# EAGLE design MVFDPanel_16S8D (EAGLE 6.2)
Assembly variants: Var1
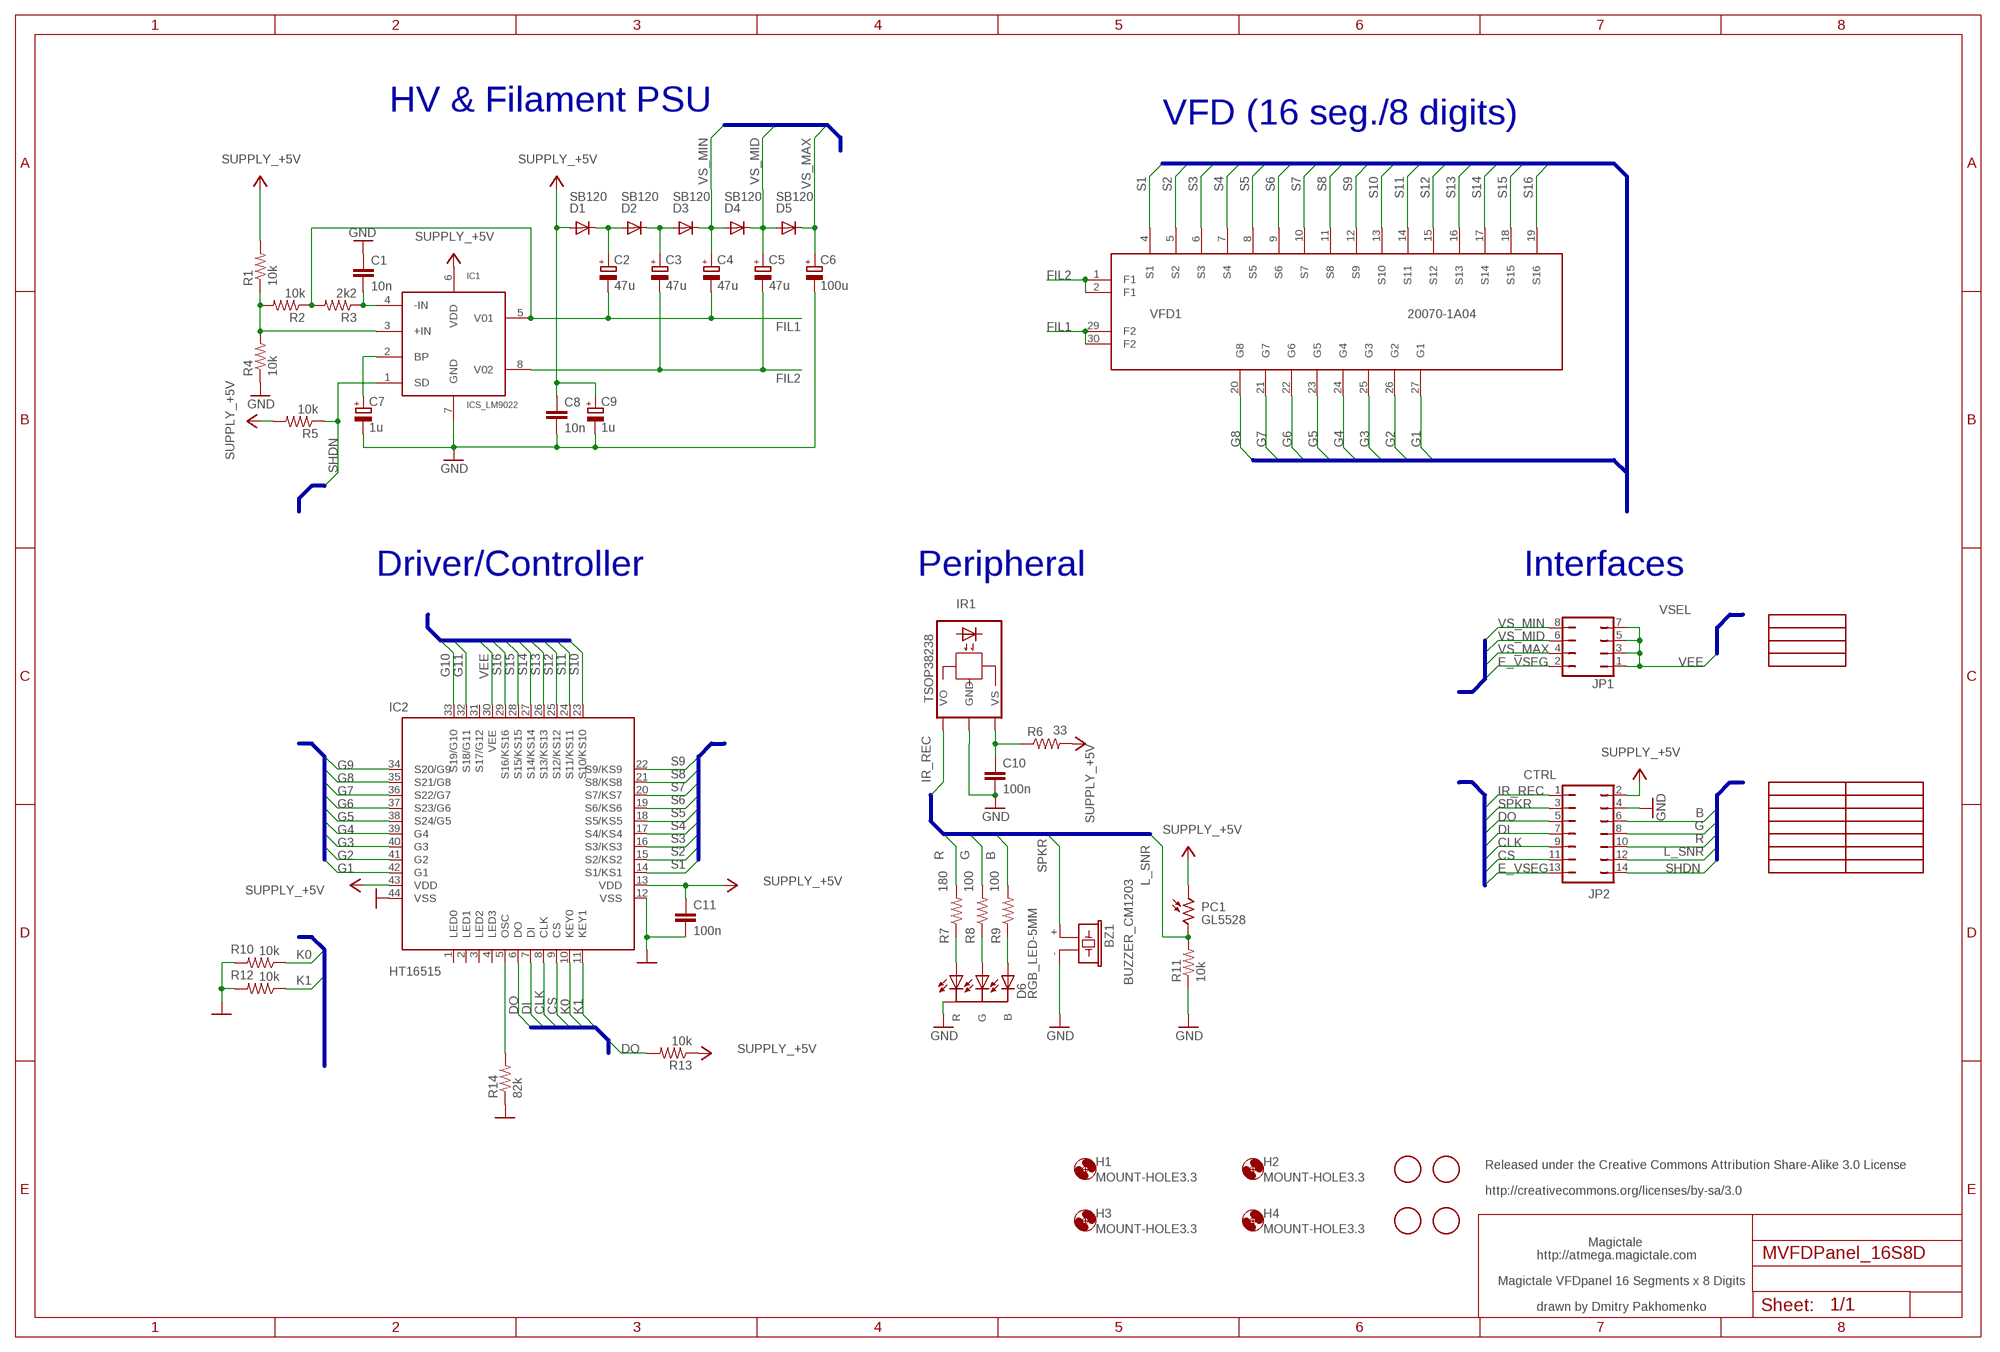
[diagram p0: schematic, sheet 1]

## Parts
BZ1  BUZZER_CM1203  [CEM-1203]
C1  10n  C-EU025-025X050  [C025-025X050]
C2  47u  CPOL-EUE2.5-7  [E2,5-7]
C3  47u  CPOL-EUE2.5-7  [E2,5-7]
C4  47u  CPOL-EUE2.5-7  [E2,5-7]
C5  47u  CPOL-EUE2.5-7  [E2,5-7]
C6  100u  CPOL-EUE3.5-8  [E3,5-8]
C7  1u  CPOL-EUE2-5  [E2-5]
C8  10n  C-EU025-025X050  [C025-025X050]
C9  1u  CPOL-EUE2-5  [E2-5]
C10  100n  C-EU050-025X075  [C050-025X075]
C11  100n  C-EU050-025X075  [C050-025X075]
D1  SB120  [DO41-10]
D2  SB120  [DO41-10]
D3  SB120  [DO41-10]
D4  SB120  [DO41-10]
D5  SB120  [DO41-10]
D6  RGB_LED-5MM  [RGB_LED-5MM]
FIDUTIAL1  FIDUCIAL  [FIDUCIAL_1MM]
FIDUTIAL2  FIDUCIAL  [FIDUCIAL_1MM]
FIDUTIAL3  FIDUCIAL  [FIDUCIAL_1MM]
FIDUTIAL4  FIDUCIAL  [FIDUCIAL_1MM]
H1  MOUNT-HOLE3.3  [3,3]
H2  MOUNT-HOLE3.3  [3,3]
H3  MOUNT-HOLE3.3  [3,3]
H4  MOUNT-HOLE3.3  [3,3]
IC1  ICS_LM9022  [ICS_SOP08]
IC2  HT16515  [LQFP44-10X10]
IR1  TSOP38238  [TSOP38238]
JP1  VSEL  JP4Q  [JP4Q]
JP2  CTRL  JP7Q  [JP7Q]
PC1  GL5528  [GL5528]
R1  10k  R-US_0207/2V  [0207/2V]
R2  10k  R-US_0207/2V  [0207/2V]
R3  2k2  R-US_0207/2V  [0207/2V]
R4  10k  R-US_0207/2V  [0207/2V]
R5  10k  R-US_0207/2V  [0207/2V]
R6  33  R-US_0207/2V  [0207/2V]
R7  180  R-US_0207/2V  [0207/2V]
R8  100  R-US_0207/2V  [0207/2V]
R9  100  R-US_0207/2V  [0207/2V]
R10  10k  R-US_0207/2V  [0207/2V]
R11  10k  R-US_0207/2V  [0207/2V]
R12  10k  R-US_0207/2V  [0207/2V]
R13  10k  R-US_0207/2V  [0207/2V]
R14  82k  R-US_0207/2V  [0207/2V]
U$1  MT_LOGO  [MT_LOGO]
U$2  HDR_7P2R_DESCR  [HDR_7P2R_DESCR]
U$3  JUMP_4X2_DESCR  [JUMP_4X2_DESCR]
VFD1  20070-1A04  [20070-1A04]

## Nets
+5V [power]: C8.1 C9.+ C11.1 D1.A IC1.6(VDD) IC2.13(VDD) IC2.43(VDD) JP2.2 PC1.1 R1.2 R5.2 R6.2 R13.1 ; supply symbol labelled SUPPLY_+5V
B: JP2.6 R9.2
CLK: IC2.8(CLK) JP2.9
CS: IC2.9(CS) JP2.11
DI: IC2.7(DI) JP2.7
DO: IC2.6(DO) JP2.5 R13.2
E_VSEG: JP1.2 JP2.13
FIL1: C2.- C4.- IC1.5(V01) R2.1 R3.2 VFD1.29(F2) VFD1.30(F2)
FIL2: C3.- C5.- IC1.8(V02) VFD1.1(F1) VFD1.2(F1)
G: JP2.8 R8.2
G1: IC2.42(G1) VFD1.27(G1)
G2: IC2.41(G2) VFD1.26(G2)
G3: IC2.40(G3) VFD1.25(G3)
G4: IC2.39(G4) VFD1.24(G4)
G5: IC2.38(S24/G5) VFD1.23(G5)
G6: IC2.37(S23/G6) VFD1.22(G6)
G7: IC2.36(S22/G7) VFD1.21(G7)
G8: IC2.35(S21/G8) VFD1.20(G8)
G9: IC2.34(S20/G9)
G10: IC2.33(S19/G10)
G11: IC2.32(S18/G11)
GND [power]: BZ1.- C1.1 C6.- C7.- C8.2 C9.- C10.2 C11.2 D6.CC IC1.7(GND) IC2.12(VSS) IC2.44(VSS) IR1.GND JP2.4 R4.1 R10.2 R11.1 R12.2 R14.1
IR_REC: IR1.VO JP2.1
K0: IC2.10(KEY0) R10.1
K1: IC2.11(KEY1) R12.1
L_SNR: JP2.12 PC1.2 R11.2
N$2: C10.1 IR1.VS R6.1
N$3: IC2.5(OSC) R14.2
N$6: C7.+ IC1.2(BP)
N$8: D6.R R7.1
N$9: D6.G R8.1
N$10: D6.B R9.1
N$11: IC1.3(+IN) R1.1 R2.2 R4.2
N$30: C2.+ D1.C D2.A
N$31: C3.+ D2.C D3.A
PORTD6: C1.2 IC1.4(-IN) R3.1
R: JP2.10 R7.2
S1: IC2.14(S1/KS1) VFD1.4(S1)
S2: IC2.15(S2/KS2) VFD1.5(S2)
S3: IC2.16(S3/KS3) VFD1.6(S3)
S4: IC2.17(S4/KS4) VFD1.7(S4)
S5: IC2.18(S5/KS5) VFD1.8(S5)
S6: IC2.19(S6/KS6) VFD1.9(S6)
S7: IC2.20(S7/KS7) VFD1.10(S7)
S8: IC2.21(S8/KS8) VFD1.11(S8)
S9: IC2.22(S9/KS9) VFD1.12(S9)
S10: IC2.23(S10/KS10) VFD1.13(S10)
S11: IC2.24(S11/KS11) VFD1.14(S11)
S12: IC2.25(S12/KS12) VFD1.15(S12)
S13: IC2.26(S13/KS13) VFD1.16(S13)
S14: IC2.27(S14/KS14) VFD1.17(S14)
S15: IC2.28(S15/KS15) VFD1.18(S15)
S16: IC2.29(S16/KS16) VFD1.19(S16)
SHDN: IC1.1(SD) JP2.14 R5.1
SPKR: BZ1.+ JP2.3
VEE: IC2.30(VEE) JP1.1 JP1.3 JP1.5 JP1.7
VS_MAX: C6.+ D5.C JP1.4
VS_MID: C5.+ D4.C D5.A JP1.6
VS_MIN: C4.+ D3.C D4.A JP1.8
Unconnected: IC2.1(LED0) IC2.2(LED1) IC2.3(LED2) IC2.4(LED3) IC2.31(S17/G12)

## Buses
CTRLBUS:R,G,B,SPKR,L_SNR,IR_REC,SPKR,DO,DI,CLK,CS,E_VSEG,SHDN,VS_MIN,VS_MID,VS_MAX,E_VSEG,VEE,G[1..12],S[1..16],K0,K1
CTRLBUS:R,G,B,SPKR,L_SNR,IR_REC,SPKR,DO,DI,CLK,CS,E_VSEG,SHDN,VS_MIN,VS_MID,VS_MAX,E_VSEG,VEE,G[1..9],S[1..9],K0,K1

## Notes on the sheet
- HV & Filament PSU
- VFD (16 seg./8 digits)
- Driver/Controller | Peripheral | Interfaces
- Released under the Creative Commons Attribution Share-Alike 3.0 License
- http://creativecommons.org/licenses/by-sa/3.0
- Magictale
- http://atmega.magictale.com
- Magictale VFDpanel 16 Segments x 8 Digits
- drawn by Dmitry Pakhomenko

## Library data of the parts
BZ1 = magictale:BUZZER_CM1203: BUZZER CEM1203, PC Mount 12mm 2.048kHz This is a small 12mm round buzzer that operates around the audible 2kHz range. We drove it directly from a 5V PIC to generate the tones for our Simon demonstration game. Use buzzers to create simple music or user interfaces. Source: http://www.sparkfun.com/datasheets/Components/CEM-1203.pdf; OC_FARNELL: unknown; OC_NEWARK: unknown; SPARKFUN: COM-07950
C1 C8 = rcl:C-EU: CAPACITOR, European symbol; DIGIKEY: 399-4150-ND
C2-C5 = rcl:CPOL-EU: POLARIZED CAPACITOR, European symbol; DIGIKEY: P11232-ND
C6 = rcl:CPOL-EU: POLARIZED CAPACITOR, European symbol; DIGIKEY: P10294-ND
C7 C9 = rcl:CPOL-EU: POLARIZED CAPACITOR, European symbol; DIGIKEY: P13468-ND
C10 C11 = rcl:C-EU: CAPACITOR, European symbol; DIGIKEY: 490-3859-ND
D1-D5 = diode:SB120: DIODE barrier rectifier, 1 A (Fairchild); DIGIKEY: MBR160-ND
D6 = magictale:RGB_LED-5MM; SPARKFUN: COM-09264
FIDUTIAL1-FIDUTIAL4 = adafruit:FIDUCIAL: For use by pick and place machines to calibrate the vision/machine, 1mm By microbuilder.eu
H1-H4 = holes:MOUNT-HOLE: MOUNTING HOLE with drill center marker
IC1 = magictale:ICS_LM9022: LM9022 VFD filament driver The LM9022 is a bridged power amplifier capable of delivering typically 2W of continuous average power into a 10Ω filament load when powered by a 5V power supply.; DIGIKEY: LM9022M-ND; RS-ONLINE: 651-2515
IC2 = magictale:HT16515: HT16515 VFD controller HT16515is a VFD (Vacuum Fluorescent Display) controller/driver that is driven on a 1/4 to 1/12 duty factor. It consists of 16 segment output lines, 4 grid output lines, 8 segment/grid output drive lines, 4 LED output ports, a control circuit, a display memory, and a key scan circuit. Serial data inputs to the HT16515 through a three-line serial interface. This VFD controller/driver is an ideal MCU peripheral device. Features Logic voltage: 5V High-voltage output: VDD-35V max. Multiple display (16-segment & 12-digit to 24-segment & 4-digit) 16×2 matrix key scanning 8 steps dimmer circuit 4 LED output ports 4-bit general purpose input port No external resistors necessary for driver output (provides PMOS open-drain and pull-low resistor output) Serial interface with MCU (CLK, CS, DI,DO) 44-pin LQFP package Source: Data sheet <http://www.holtek.com/pdf/consumer/ht16515v190.pdf>
IR1 = magictale:TSOP38238: TSOP382... IR Receiver Modules for Remote Control Systems The TSOP382 is a miniaturized receiver for infrared remote control systems. A PIN diode and a preamplifier are assembled on a lead frame while the epoxy package acts as an IR filter. The demodulated output signal can be directly decoded by a microprocessor. The TSOP382 is compatible with all common IR remote control data formats. Source: http://www.sparkfun.com/datasheets/Sensors/Infrared/tsop382.pdf; DIGIKEY: 751-1227-ND
JP1 = jumper:JP4Q: JUMPER
JP2 = jumper:JP7Q: JUMPER
PC1 = magictale:GL5528: Photoconductive Cell GL5528 A photocell changes (also called a photodetector, photo resistor, CdS or photoconductive cell) resistance depending on the amount of light it is exposed to. These little sensors make great ambient light triggers (when light in the room turns on, do something). Source: http://www.sparkfun.com/datasheets/Sensors/Imaging/SEN-09088-datasheet.pdf; SPARKFUN: SEN-09088
R1 R2 R4 R5 R10-R13 = resistor:R-US_: RESISTOR, American symbol; DIGIKEY: 10KQBK-ND
R3 = resistor:R-US_: RESISTOR, American symbol; DIGIKEY: 2.2KQTR-ND
R6 = resistor:R-US_: RESISTOR, American symbol; DIGIKEY: 33QBK-ND
R7 = resistor:R-US_: RESISTOR, American symbol; DIGIKEY: 180QBK-ND
R8 R9 = resistor:R-US_: RESISTOR, American symbol; DIGIKEY: 100QBK-ND
R14 = resistor:R-US_: RESISTOR, American symbol; DIGIKEY: 82KQBK-ND
U$1 = magictale:MT_LOGO; LICENSE: CC3.0; PCBREV: REV 1.0, 2013.04.06; PROJECT: MVFDpanel16S8D; URL: http://atmega.magictale.com
U$2 = magictale:HDR_7P2R_DESCR; P1: IR_REC; P10: R; P11: CS; P12: L_SNR; P13: VSEG; P14: SHDN; P2: +5V; P3: SPKR; P4: G ND; P5: DO; P6: B; P7: DI; P8: G; P9: CLK
U$3 = magictale:JUMP_4X2_DESCR; OPT1: 15V; OPT2: 20V; OPT3: 25V; OPT4: EXT
VFD1 = magictale:20070-1A04: 16 Segments 8 Digits VFD

## Net classes
0 default: width 0.406 mm, drill 0.508 mm, clearance 0.254 mm
1 power: width 0.508 mm, drill 0.508 mm, clearance 0.254 mm

## Board
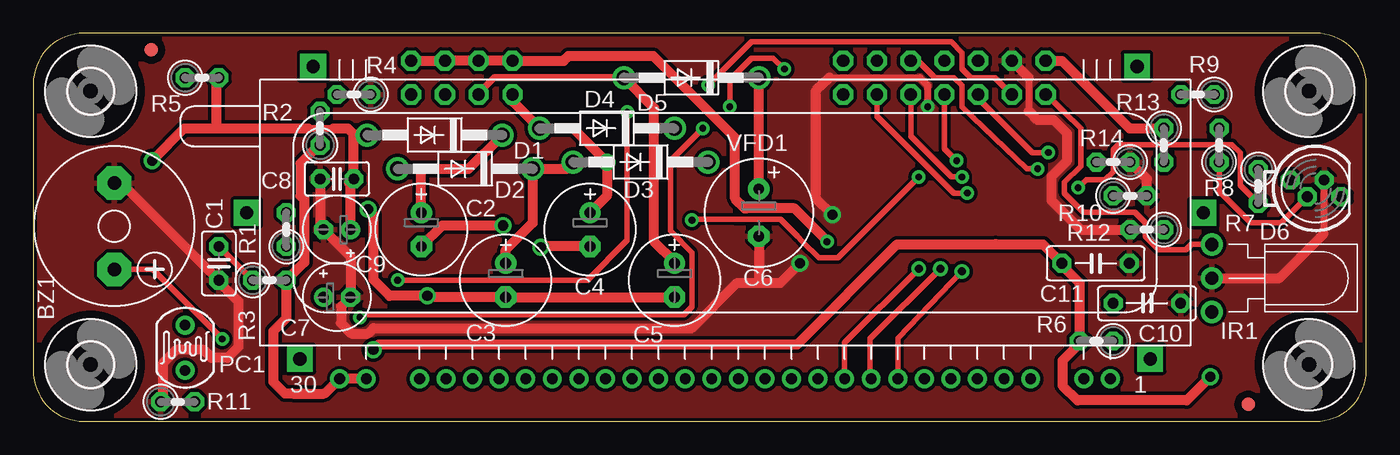
[diagram p1: board, top side]
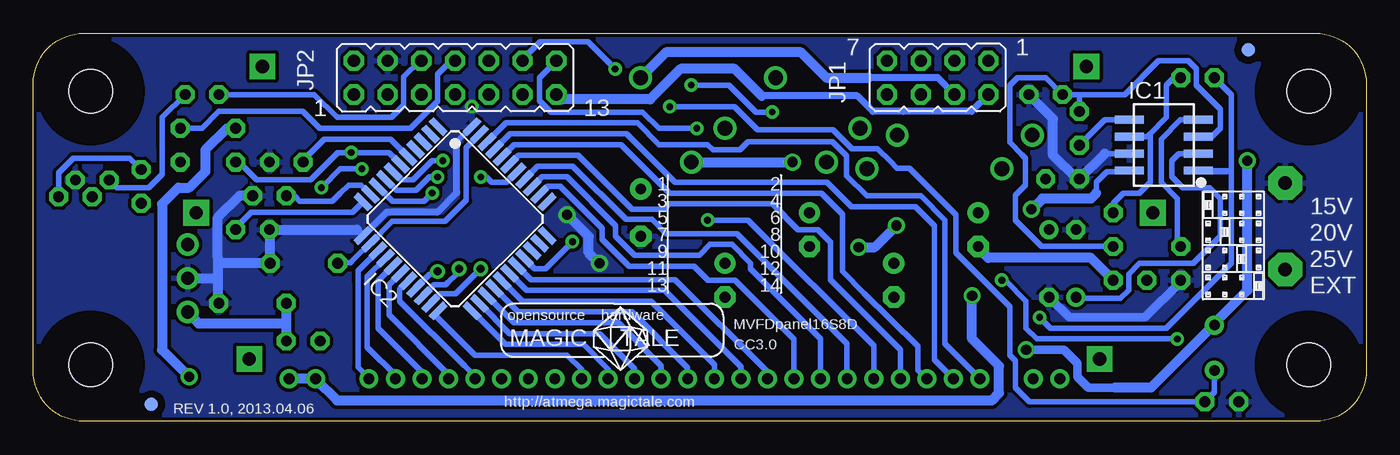
[diagram p2: board, bottom side, seen from below]

Size 100.33 x 29.2 mm. Coordinates in mm from the lower left corner, seen from the top.
Outline: 0,25.39 0,3.81 arc90 3.81,0 96.52,0 arc90 100.33,3.81 100.33,25.39 arc90 96.52,29.2 3.81,29.2 arc90 0,25.39
Copper layers (1*16): Top 0.035mm / dielectric 1.5mm / Bottom 0.035mm
Design rules: minimum track width 8mil, minimum drill 20mil, track to track 8mil, track to pad 8mil, pad to pad 8mil, via to via 8mil, smd to smd 8mil, copper to edge 10mil, drill to drill 8mil, minimum pad ring 12mil, minimum via ring 10mil, stop-mask expansion 4mil, vias tented up to drill 25mil, thermal gap 10mil

### Footprints (pad centres in the part's own frame; a part is rotated, then mirrored left to right if it is on the bottom)
CEM-1203 = drill 1.016 pad 2.54 octagon: + 3.25,0; - -3.25,0
C025-025X050 = drill 0.813 octagon: 1 -1.27,0; 2 1.27,0
E2,5-7 = drill 0.813 pad 1.6: + -1.27,0 | drill 0.813 pad 1.6 octagon: - 1.27,0
E3,5-8 = drill 0.813 pad 1.6: + -1.778,0 | drill 0.813 pad 1.6 octagon: - 1.778,0
E2-5 = drill 0.813 pad 1.27: + -1.016,0 | drill 0.813 pad 1.27 octagon: - 1.016,0
C050-025X075 = drill 0.813 octagon: 1 -2.54,0; 2 2.54,0
DO41-10 = drill 1.118: A 5.08,0; C -5.08,0
RGB_LED-5MM = drill 0.813 octagon: B -1.905,0.635; CC 0.635,0.635; G -0.635,-0.635; R 1.905,-0.635
FIDUCIAL_1MM = smd 1 x 1: 1 0,0
3,3 = hole 3.3: 0,0
ICS_SOP08 = smd 0.6 x 2.2: 1 -1.905,-2.6; 2 -0.635,-2.6; 3 0.635,-2.6; 4 1.905,-2.6; 5 1.905,2.6; 6 0.635,2.6; 7 -0.635,2.6; 8 -1.905,2.6
LQFP44-10X10 = smd 1.5 x 0.5: 1 -5.8,4; 2 -5.8,3.2; 3 -5.8,2.4; 4 -5.8,1.6; 5 -5.8,0.8; 6 -5.8,0; 7 -5.8,-0.8; 8 -5.8,-1.6; 9 -5.8,-2.4; 10 -5.8,-3.2; 11 -5.8,-4; 23 5.8,-4; 24 5.8,-3.2; 25 5.8,-2.4; 26 5.8,-1.6; 27 5.8,-0.8; 28 5.8,0; 29 5.8,0.8; 30 5.8,1.6; 31 5.8,2.4; 32 5.8,3.2; 33 5.8,4 | smd 0.5 x 1.5: 12 -4,-5.8; 13 -3.2,-5.8; 14 -2.4,-5.8; 15 -1.6,-5.8; 16 -0.8,-5.8; 17 0,-5.8; 18 0.8,-5.8; 19 1.6,-5.8; 20 2.4,-5.8; 21 3.2,-5.8; 22 4,-5.8; 34 4,5.8; 35 3.2,5.8; 36 2.4,5.8; 37 1.6,5.8; 38 0.8,5.8; 39 0,5.8; 40 -0.8,5.8; 41 -1.6,5.8; 42 -2.4,5.8; 43 -3.2,5.8; 44 -4,5.8
TSOP38238 = drill 1 pad 1.676: GND 0,-6.54; VO -2.54,-6.54; VS 2.54,-6.54
JP4Q = drill 0.914 octagon: 1 -3.81,-1.27; 2 -3.81,1.27; 3 -1.27,-1.27; 4 -1.27,1.27; 5 1.27,-1.27; 6 1.27,1.27; 7 3.81,-1.27; 8 3.81,1.27
JP7Q = drill 0.914 octagon: 1 -7.62,-1.27; 2 -7.62,1.27; 3 -5.08,-1.27; 4 -5.08,1.27; 5 -2.54,-1.27; 6 -2.54,1.27; 7 0,-1.27; 8 0,1.27; 9 2.54,-1.27; 10 2.54,1.27; 11 5.08,-1.27; 12 5.08,1.27; 13 7.62,-1.27; 14 7.62,1.27
GL5528 = drill 0.8 pad 1.4: 1 -1.7,0; 2 1.7,0
0207/2V = drill 0.813 octagon: 1 -1.27,0; 2 1.27,0
20070-1A04 = drill 0.813: 1 -29,12.5; 2 -27,12.5; 4 -23,12.5; 5 -21,12.5; 6 -19,12.5; 7 -17,12.5; 8 -15,12.5; 9 -13,12.5; 10 -11,12.5; 11 -9,12.5; 12 -7,12.5; 13 -5,12.5; 14 -3,12.5; 15 -1,12.5; 16 1,12.5; 17 3,12.5; 18 5,12.5; 19 7,12.5; 20 9,12.5; 21 11,12.5; 22 13,12.5; 23 15,12.5; 24 17,12.5; 25 19,12.5; 26 21,12.5; 27 23,12.5; 29 27,12.5; 30 29,12.5 | drill 1 pad 1.93 square: P$1 -31,-11; P$2 -36,0; P$3 31,-11; P$4 36,0; P$5 -32,11; P$6 32,11

### Placement (x,y rotation side)
BZ1  6.1,14.68 270 top
C1  13.97,11.89 90 top
C2  29.21,14.43 270 top
C3  35.56,10.62 270 top
C4  41.91,14.43 270 top
C5  48.26,10.62 270 top
C6  54.61,15.7 270 top
C7  22.86,9.35 0 top
C8  22.86,18.24 180 top
C9  22.86,14.43 180 top
C10  83.82,8.89 0 top
C11  79.96,11.89 0 top
D1  30.23,21.54 180 top
D2  32.51,19 180 top
D3  45.72,19.51 180 top
D4  43.18,22.05 180 top
D5  49.53,25.86 180 top
D6  96.52,17.53 0 top
FIDUTIAL1  8.89,27.94 0 top
FIDUTIAL2  91.44,1.27 0 top
FIDUTIAL3  8.89,27.94 0 bottom
FIDUTIAL4  91.44,1.27 0 bottom
H1  96.01,4.27 0 top
H2  96.01,24.84 0 top
H3  4.32,24.84 0 top
H4  4.32,4.27 0 top
IC1  15.24,20.78 90 bottom
IC2  68.58,15.24 315 bottom
IR1  95.25,10.77 270 top
JP1  32.26,25.86 180 bottom
JP2  68.58,25.86 0 bottom
PC1  11.43,5.54 270 top
R1  19.05,14.43 90 top
R2  21.59,22.05 90 top
R3  17.78,10.62 0 top
R4  24.13,24.59 180 top
R5  12.7,25.86 0 top
R6  80.01,6.05 180 top
R7  92.2,17.68 270 top
R8  89.26,20.78 90 top
R9  87.63,24.59 180 top
R10  82.55,16.97 0 top
R11  10.87,1.47 0 top
R12  83.82,14.43 180 top
R13  85.09,20.78 270 top
R14  81.28,19.51 180 top
U$1  55.88,6.35 0 bottom
U$2  44.96,13.46 0 bottom
U$3  13.82,13.36 180 bottom
VFD1  52.07,15.7 180 top

### Tracks (layer width: path | path; a pad name or v marks a point on that pad's centre or on a via)
+5V  (via drill 0.76)
  Top 0.508: 20.73,22.05 22.61,22.05
  Top 0.762: C9.+ 23.88,17.98 | v8.94,19.61 11.38,22.05 13.82,22.05 | 13.82,22.05 13.82,25.71 R5.2 | v25.6,5.39 26.01,5.79 56.08,5.79 57.51,5.79 65.02,13.31 72.34,13.31 | 13.82,22.05 20.73,22.05 | 22.61,22.05 23.11,22.05 23.67,22.05 24.13,21.59 | JP2.2 77.42,27.13 82.5,22.05 R13.1 | v88.59,3.35 86.82,1.58 78.59,1.58 77.47,2.69 77.47,4.57 77.98,5.08 78.94,6.05 R6.2 78.74,10.41 77.42,11.73 C11.1 76,13.31 72.54,13.31 | 72.34,13.31 72.54,13.31 | 72.54,13.31 72.34,13.31 | 72.34,13.31 72.54,13.31 | 72.54,13.31 72.34,13.31 | 72.34,13.31 72.54,13.31 | C8.1 24.13,21.59 | 24.13,21.59 25.09,21.59 D1.A
  Top 1.016: 23.88,17.98 C8.1
  Bottom 0.406: IC2.43 67.74,20.59 67.74,16.62 69.33,15.04 69.55,15.04 73.28,15.04 73.31,15.04 IC2.13 74.99,13.4 76.2,12.19 76.45,11.94 77.37,11.94 C11.1 | R5.2 14.48,25.86 15.04,25.3 15.04,22.86 16.26,21.64 | IC1.6 16.48,21.41 16.26,21.64 | R1.2 19.05,16.41 18.29,17.17 17.07,17.17 16.26,17.98 16.26,21.64
  Bottom 0.635: 18.9,2.54 20.93,2.54 21.74,3.35 21.74,4.37 22.76,5.39 v25.6,5.39
  Bottom 0.762: v8.94,19.61 8.94,9.86 11.43,7.37 PC1.1 11.51,7.24 16.2,2.54 18.9,2.54 | v88.59,3.35 90.63,5.39 90.63,16.36 89.81,17.17 89.41,17.58 88.59,17.58 87.38,18.8 87.38,19.61 87.38,20.42 85.75,22.05 R13.1
B
  Bottom 0.406: R9.2 79.2,24.59 77.47,22.86 73.36,22.86 72.44,23.77 72.44,23.88 72.44,25.91 71.22,27.13 JP2.6
CLK  (via drill 0.51)
  Top 0.406: JP2.9 66.04,21.44 69.09,18.39 v69.9,18.39
  Bottom 0.406: IC2.8 72.98,17.37 71.53,17.37 70.51,18.39 v69.9,18.39
CS  (via drill 0.51)
  Top 0.406: JP2.11 63.5,22.96 69.29,17.17 v70.31,17.17
  Bottom 0.406: 73.91,17.17 IC2.9 73.3,16.56 70.92,16.56 v70.31,17.17
DI  (via drill 0.51)
  Top 0.406: JP2.7 68.58,20.52 v69.49,19.61
  Bottom 0.406: v69.49,19.61 70.31,19.61 71.73,18.16 72.66,18.16 IC2.7
DO  (via drill 0.51)
  Top 0.406: JP2.5 71.12,24.49 71.12,24.28 75.18,20.22 v76.4,20.22
  Bottom 0.406: IC2.6 73.56,20.22 74.78,20.22 v76.4,20.22 77.42,20.22 78.84,18.8 79.45,18.19 83.52,18.19 84.84,19.51 R13.2
E_VSEG
  Bottom 0.508: 45.52,24.49 38.3,24.49 37.13,23.32 34.85,23.32 29.72,23.32 JP1.2
  Bottom 0.762: JP2.13 60.55,24.23 53.9,24.23 51.61,26.52 47.55,26.52 45.52,24.49
FIL1  (via drill 0.76)
  Top 0.406: R2.1 21.49,20.78
  Top 0.762: 21.49,20.78 20.12,19.41 20.12,16.97 20.4,16.76 20.4,11.96 R3.2 19.05,7.77 18.09,6.81 18.09,5.18 18.09,2.95 18.95,2.08 19.51,2.08 20.32,2.08 21.89,2.08 21.95,2.13 22.01,2.13 VFD1.30 VFD1.29 | C4.- 38.25,13.16 v38.2,13.11 | v35.36,14.73 30.79,14.73 C2.-
  Bottom 0.406: 29.26,13.11 29.16,13.11 C2.- | IC1.5 19.68,22.68 R2.1
  Bottom 0.762: R3.2 20.73,12.29 28.45,12.29 29.26,13.11 | v38.2,13.11 36.98,13.11 v35.36,14.73
FIL2  (via drill 0.76)
  Top 0.762: C5.- C3.- 29.77,9.35 v29.67,9.45 26.82,9.45 25.6,10.67 25.6,15.55 v25.2,15.95
  Bottom 0.406: IC1.8 17.84,18.84 17.88,18.8 19.51,18.8 20.32,17.98 20.32,17.17
  Bottom 0.762: 20.32,17.17 20.73,16.76 24.38,16.76 v25.2,15.95 | v29.67,9.45 29.67,6.2 29.26,5.79 27.64,4.17 27.64,2.13 28.19,1.58 77.47,1.58 79.07,3.18 VFD1.2 VFD1.1
G
  Bottom 0.406: R8.2 87.63,22.05 86.36,23.32 80.06,23.32 78.79,22.05 71.93,22.05 69.9,24.08 69.9,26.11 68.89,27.13 JP2.8
G1
  Bottom 0.406: IC2.42 64.76,22.45 54.86,22.45 53.24,20.83 49.58,20.83 49.17,20.42 47.14,20.42 46.53,21.03 40.18,21.03 39.12,19.96 39.12,18.54 39.12,18.49 37.59,16.97 33.53,16.97 31.7,15.14 31.7,12.29 31.7,5.83 VFD1.27
G2
  Bottom 0.406: IC2.41 64.44,21.64 55.68,21.64 52.02,17.98 44.09,17.98 43.08,17.98 40.59,17.98 38.76,16.15 33.93,16.15 32.51,14.73 32.51,11.89 32.51,4.64 VFD1.26
G3
  Bottom 0.406: IC2.40 64.12,20.83 56.08,20.83 52.43,17.17 43.48,17.17 42.67,17.17 41,17.17 39.42,15.6 39.42,11.28 37.8,9.65 33.73,5.64 33.73,3.86 VFD1.25
G4
  Bottom 0.406: IC2.39 63.8,20.02 59.33,20.02 55.27,15.95 52.83,15.95 52.43,16.36 44.7,16.36 42.77,14.43 42.67,14.43 41.45,14.43 41.25,14.43 40.39,13.56 40.34,13.51 40.34,10.67 35.36,5.69 35.07,5.4 VFD1.24
G5  (via drill 0.51)
  Top 0.406: 55.68,15.19 52.83,15.19 49.63,15.19 v49.58,15.14 | 55.68,15.19 56.24,15.19 | 56.24,15.19 55.68,15.19 | 55.68,15.19 56.24,15.19 | 56.24,15.19 57.51,13.92 57.91,13.51 59.13,12.29 60.55,12.29 61.37,13.11 v66.65,18.39
  Bottom 0.406: VFD1.23 37.07,5.68 46.33,14.94 46.53,15.14 v49.58,15.14 | v66.65,18.39 66.24,18.39 65.84,17.98 64.7,17.98 IC2.38
G6
  Bottom 0.406: VFD1.22 39.07,5.85 47.35,14.12 52.63,14.12 52.7,14.12 53.77,15.19 55.68,15.19 55.73,15.19 59.74,19.2 62.35,19.2 IC2.37
G7
  Bottom 0.406: IC2.36 62.04,18.39 60.15,18.39 56.49,14.73 56.49,13.92 55.07,12.5 50.19,12.5 49.38,13.31 47.75,13.31 46.33,11.89 46.33,11.48 41.07,6.22 VFD1.21
G8
  Bottom 0.406: VFD1.20 43.07,6.19 47.5,10.62 47.55,10.62 49.58,10.62 49.58,10.67 50.6,11.68 55.47,11.68 57.51,13.72 57.51,14.53 60.63,17.65 60.66,17.68 61.59,17.68 61.62,17.68 IC2.35 62.27,17.08
G9
  Bottom 0.406: IC2.34 61.65,16.48
G10
  Bottom 0.406: IC2.33
GND  (via drill 0.51, 0.76)
  Top 0.508: 74.93,25.86 74.93,23.32 | 59.94,25.86 66.75,25.86 67.31,25.3 v67.31,23.67 | 97.13,14.12 97.13,18.14 D6.CC
  Top 0.762: C8.2 21.59,14.68 C9.- 23.88,12.4 C7.- 23.16,8.64 23.16,7.42 23.98,6.6 25.2,6.6 25.6,7.01 49.58,7.01 52.98,10.41 54.86,10.41 | JP2.4 74.93,25.86 | R12.2 78.84,14.43 76.66,16.61 76.66,18.44 77.42,19.2 77.83,19.61 77.83,20.63 77.83,21.64 77.22,22.25 76.81,22.66 75.59,22.66 74.93,23.32 | BZ1.- 6.66,17.93 C1.1 13.97,10.52 15.44,9.04 15.44,5.59 14.63,4.77 13.41,4.77 13.01,5.18 12.8,5.39 10.77,5.39 9.75,4.37 9.75,1.63 R11.1 | 54.86,10.41 56.24,10.41 v57.71,11.89 | C6.- 54.61,10.67 54.86,10.41 | v60.15,15.55 58.93,16.76 58.93,24.89 59.94,25.86 | IR1.GND 93.78,10.77 97.13,14.12 | R10.2 83.82,18.24 R14.1
  Bottom 0.406: IC1.7 19.68,20.14 | v67.31,23.67 | 68.45,20.9 68.45,21.02 IC2.44 | 68.45,17.27 68.45,17.2
  Bottom 0.508: 75.97,14.43 IC2.12 73.73,15.75 73.71,15.75 69.95,15.75 69.9,15.75 68.45,17.2 | 68.45,17.27 68.45,20.9 | 67.26,22.22 IC2.44
  Bottom 0.635: C7.- 22.35,7.82 16.66,7.82 13.97,10.52
  Bottom 0.762: R12.2 75.97,14.43 | R10.2 84.73,16.97 84.81,16.97 86.44,15.34 86.44,12.29 86.44,11.68 | R12.2 82.8,14.43 | 19.68,20.14 C8.2 21.79,18.24 23.57,20.02 23.57,22.76 R4.1 | v57.71,11.89 58.52,12.7 58.52,13.92 v60.15,15.55 | 13.97,10.52 C1.1 | 86.44,11.68 86.44,10.92 | 86.44,10.92 86.44,8.97 C10.2 | IR1.GND 86.59,10.77 86.44,10.92 | 86.44,11.68 86.23,11.89 C11.2 82.5,14.38 R12.2
  pour Top: 100.33,3.81 100.33,25.4 arc90 96.52,29.21 3.81,29.21 arc90 0,25.4 0,3.81 arc90 3.81,0 96.52,0 arc90
  pour Bottom: 100.33,3.81 100.33,25.4 arc90 96.52,29.21 3.81,29.21 arc90 0,25.4 0,3.81 arc90 3.81,0 96.52,0 arc90
IR_REC
  Top 0.406: JP2.1 76.3,24.59 77.62,23.27 78.84,22.05 78.84,19.2 77.62,17.98 77.62,17.17 79.05,15.75 82.91,15.75 83.72,14.94 83.72,13.92 84.73,12.9 86.77,12.9 87.17,13.31 IR1.VO
K0
  Bottom 0.406: R10.1 80.67,16.97 80.26,16.56 77.83,16.56 77.22,17.17 76.61,17.78 75.64,17.78 IC2.10
K1
  Bottom 0.406: R12.1 85.09,14.58 83.92,15.75 79.65,15.75 76.27,15.75 IC2.11
L_SNR  (via drill 0.51)
  Top 0.406: v52.43,23.67 52.43,25.71 54.05,27.33 55.68,27.33 56.49,26.52 v56.54,26.52
  Bottom 0.305: 37.08,20.52 38,20.52
  Bottom 0.406: JP2.12 63.5,27.23 62.18,28.55 58.57,28.55 v56.54,26.52 | v52.43,23.67 47.55,23.67 45.82,21.95 40.13,21.95 38.71,20.52 38,20.52 37.08,20.52 36.78,20.52 35.81,19.56 35.31,19.05 34.39,19.05 34.34,19 30.89,15.55 30.89,12.7 26.82,8.64 26.82,4.98 26.42,4.57 26.42,2.54 25.6,1.73 25.35,1.47 R11.2 11.43,2.18 PC1.2
N$2
  Bottom 0.762: IR1.VS 88.71,8.19 87.88,7.37 81.53,7.37 81.28,7.62 | C10.1 81.28,7.62 | 81.28,7.62 R6.1
N$3
  Bottom 0.406: IC2.5 73.44,21.23 77.62,21.23 78.44,21.23 80.01,19.66 R14.2
N$6
  Bottom 0.406: IC1.2 14.1,20.14 14.63,19.61 14.63,18.39 13.82,17.58 11.79,17.58 10.97,16.76 10.97,13.92 13.01,11.89 17.07,11.89 17.88,11.07 17.88,9.86 18.49,9.25 21.74,9.25 C7.+
N$8
  Bottom 0.406: R7.1 93.07,19.81 97.33,19.81 98.35,18.8 98.42,18.72 D6.R
N$9
  Top 0.406: R8.1 89.26,17.32 89.41,17.17 89.81,16.76 90.63,15.95 91.64,14.94 93.93,14.94 D6.G
N$10
  Bottom 0.406: 89,24.49 R9.1 90.63,22.86 90.63,20.83 90.63,20.63 90.63,18.59 91.64,17.58 94.03,17.58 D6.B
N$11
  Bottom 0.406: IC1.3 11.61,21.41 10.97,22.05 10.97,23.47 12.8,25.3 12.8,26.52 13.41,27.13 15.65,27.13 18.19,24.59 21.59,24.59 | R1.1 24.43,13.16 26.42,15.14 26.42,17.02 25.65,17.78 25.65,18.8 25.65,19.05 25.65,19.81 25.91,20.07 26.82,20.98 26.82,25.3 26.26,25.86 24.13,25.86 R4.2 21.59,24.59 | R2.2 21.59,24.59
N$30
  Top 0.762: D2.A 29.21,19 | 29.21,19 31.5,19 32.77,19 D1.C | C2.+ 29.21,19
N$31
  Top 0.762: C3.+ 35.56,12.9 37.59,14.94 D2.C 40.13,19 D3.A
PORTD6
  Top 0.406: R3.1 C1.2
  Bottom 0.406: IC1.4 13.99,22.68 15.44,21.23 15.44,17.98 14.22,16.76 14.22,13.41 C1.2
R  (via drill 0.51)
  Top 0.406: v75.59,19 74.78,19 69.9,23.67 69.9,25.3 69.29,25.86 67.87,25.86 66.6,27.13 JP2.10 | v78.64,17.58 79.25,18.19 80.67,18.19 81.28,18.8 81.28,20.42 81.69,20.83 88.19,20.83 90.22,20.83 90.83,20.22 90.83,17.78 R7.2
  Bottom 0.406: v75.59,19 77.22,19 v78.64,17.58
S1
  Bottom 0.406: IC2.14 75.88,11.33 75.88,10.52 75.88,4.05 75.07,3.24 VFD1.4
S2
  Bottom 0.406: VFD1.5 73.07,3.47 75.18,5.59 75.18,10.09 75.18,10.9 IC2.15
S3
  Bottom 0.406: VFD1.6 71.07,3.71 74.37,7.01 74.37,10.58 IC2.16
S4
  Bottom 0.406: IC2.17 73.56,10.26 73.56,8.64 73.56,8.03 69.09,3.56 69.09,3.22 VFD1.7
S5
  Bottom 0.406: IC2.18 72.75,9.94 72.75,9.04 67.88,4.18 67.07,3.37 VFD1.8
S6  (via drill 0.6)
  Top 0.406: VFD1.9 65.07,6.24 v69.9,11.28
  Bottom 0.406: IC2.19 70.48,11.07 70.1,11.07 v69.9,11.28
S7  (via drill 0.6)
  Top 0.406: VFD1.10 62.99,3.2 62.99,6.2 v68.28,11.48
  Bottom 0.406: v68.28,11.48 68.48,11.28 68.48,11.07 69.09,10.47 69.29,10.26 70.16,10.26 IC2.20
S8  (via drill 0.6)
  Top 0.406: VFD1.11 61.07,5.9 v66.65,11.48
  Bottom 0.406: v66.65,11.48 66.67,11.48 68.56,9.6 69.6,9.6 69.69,9.6 IC2.21
S9
  Bottom 0.406: IC2.22 69.53,8.64 70.1,8.03 67.06,4.98 60.15,4.98 59.07,3.9 VFD1.12
S10
  Bottom 0.406: IC2.23 64.79,5.79 58.93,5.79 57.07,3.93 VFD1.13
S11
  Bottom 0.406: VFD1.14 55.07,3.97 57.71,6.6 64.47,6.6 IC2.24
S12
  Bottom 0.406: IC2.25 64.15,7.42 57.29,7.42 56.29,7.42 53.07,4.2 VFD1.15
S13
  Bottom 0.406: VFD1.16 51.07,4.03 55.27,8.23 63.83,8.23 IC2.26
S14
  Bottom 0.406: IC2.27 63.51,9.04 54.86,9.04 53.85,9.04 49.07,4.26 VFD1.17
S15
  Bottom 0.406: IC2.28 63.2,9.86 52.83,9.86 47.07,4.09 VFD1.18
S16
  Bottom 0.406: VFD1.19 45.07,3.72 52.02,10.67 62.88,10.67 IC2.29
SHDN  (via drill 0.51)
  Top 0.406: v50.39,22.05 49.38,21.03 47.95,19.61 47.95,19.35 47.95,14.33 49.58,12.7 49.58,8.64 48.97,8.03 24.79,8.03 v24.59,7.82
  Bottom 0.406: R5.1 10.16,24.59 10.16,18.8 | 10.16,18.8 12.56,18.8 IC1.1 10.24,18.87 10.16,18.8 | JP2.14 62.23,25.86 62.23,24.13 61.37,23.27 54.46,23.27 53.24,22.05 v50.39,22.05 | 10.16,18.8 10.16,11.89 15.04,7.01 23.77,7.01 v24.59,7.82
SPKR  (via drill 0.51)
  Top 0.406: JP2.3 72.39,25.86 70.56,25.86 69.9,26.52 69.9,27.74 69.09,28.55 54.05,28.55 v50.8,25.3 | v44.7,23.27 44.7,13.92 44.7,13.61 41.71,10.62 41.66,10.62 v27.43,10.62 | v14.22,6.2 8.99,11.43 BZ1.+
  Bottom 0.406: v50.8,25.3 47.95,25.3 45.92,23.27 v44.7,23.27 | v14.22,6.2 24.79,6.2 25.6,7.01 25.6,9.04 27.18,10.62 v27.43,10.62
VEE  (via drill 0.51)
  Top 0.762: JP1.1 JP1.3 JP1.5 JP1.7 39.93,27.13 40.28,27.48 46.69,27.48 52.83,21.34 52.83,16.76 53.57,16.03 53.65,16.03 57.3,16.03 59.74,13.59 v59.74,13.51
  Bottom 0.406: IC2.30 63.35,12.24 62.59,11.48 61.77,11.48 v59.74,13.51
VS_MAX
  Top 0.762: C6.+ D5.C
  Bottom 0.508: JP1.4 32.26,25.86 37.44,25.86
  Bottom 0.762: D5.C 52.7,27.76 42.55,27.76 40.64,25.86 37.44,25.86
VS_MID
  Top 0.406: JP1.6 33.53,24.69
  Top 0.508: 33.53,24.69 34.7,25.86 D5.A
  Top 0.762: C5.+ 48.26,11.99 46.74,13.51 46.74,22.05 | D4.C 46.74,22.05 | 46.74,22.05 46.74,23.57 D5.A
VS_MIN  (via drill 0.76)
  Top 0.762: C4.+ 43.18,16.97 v43.18,19.51 40.64,22.05 D4.A 36.07,24.08 JP1.8
  Bottom 0.762: D3.C v43.18,19.51